# EAGLE design sVNS_16chan (EAGLE 9.6.2)

## Sheet 1 of 3
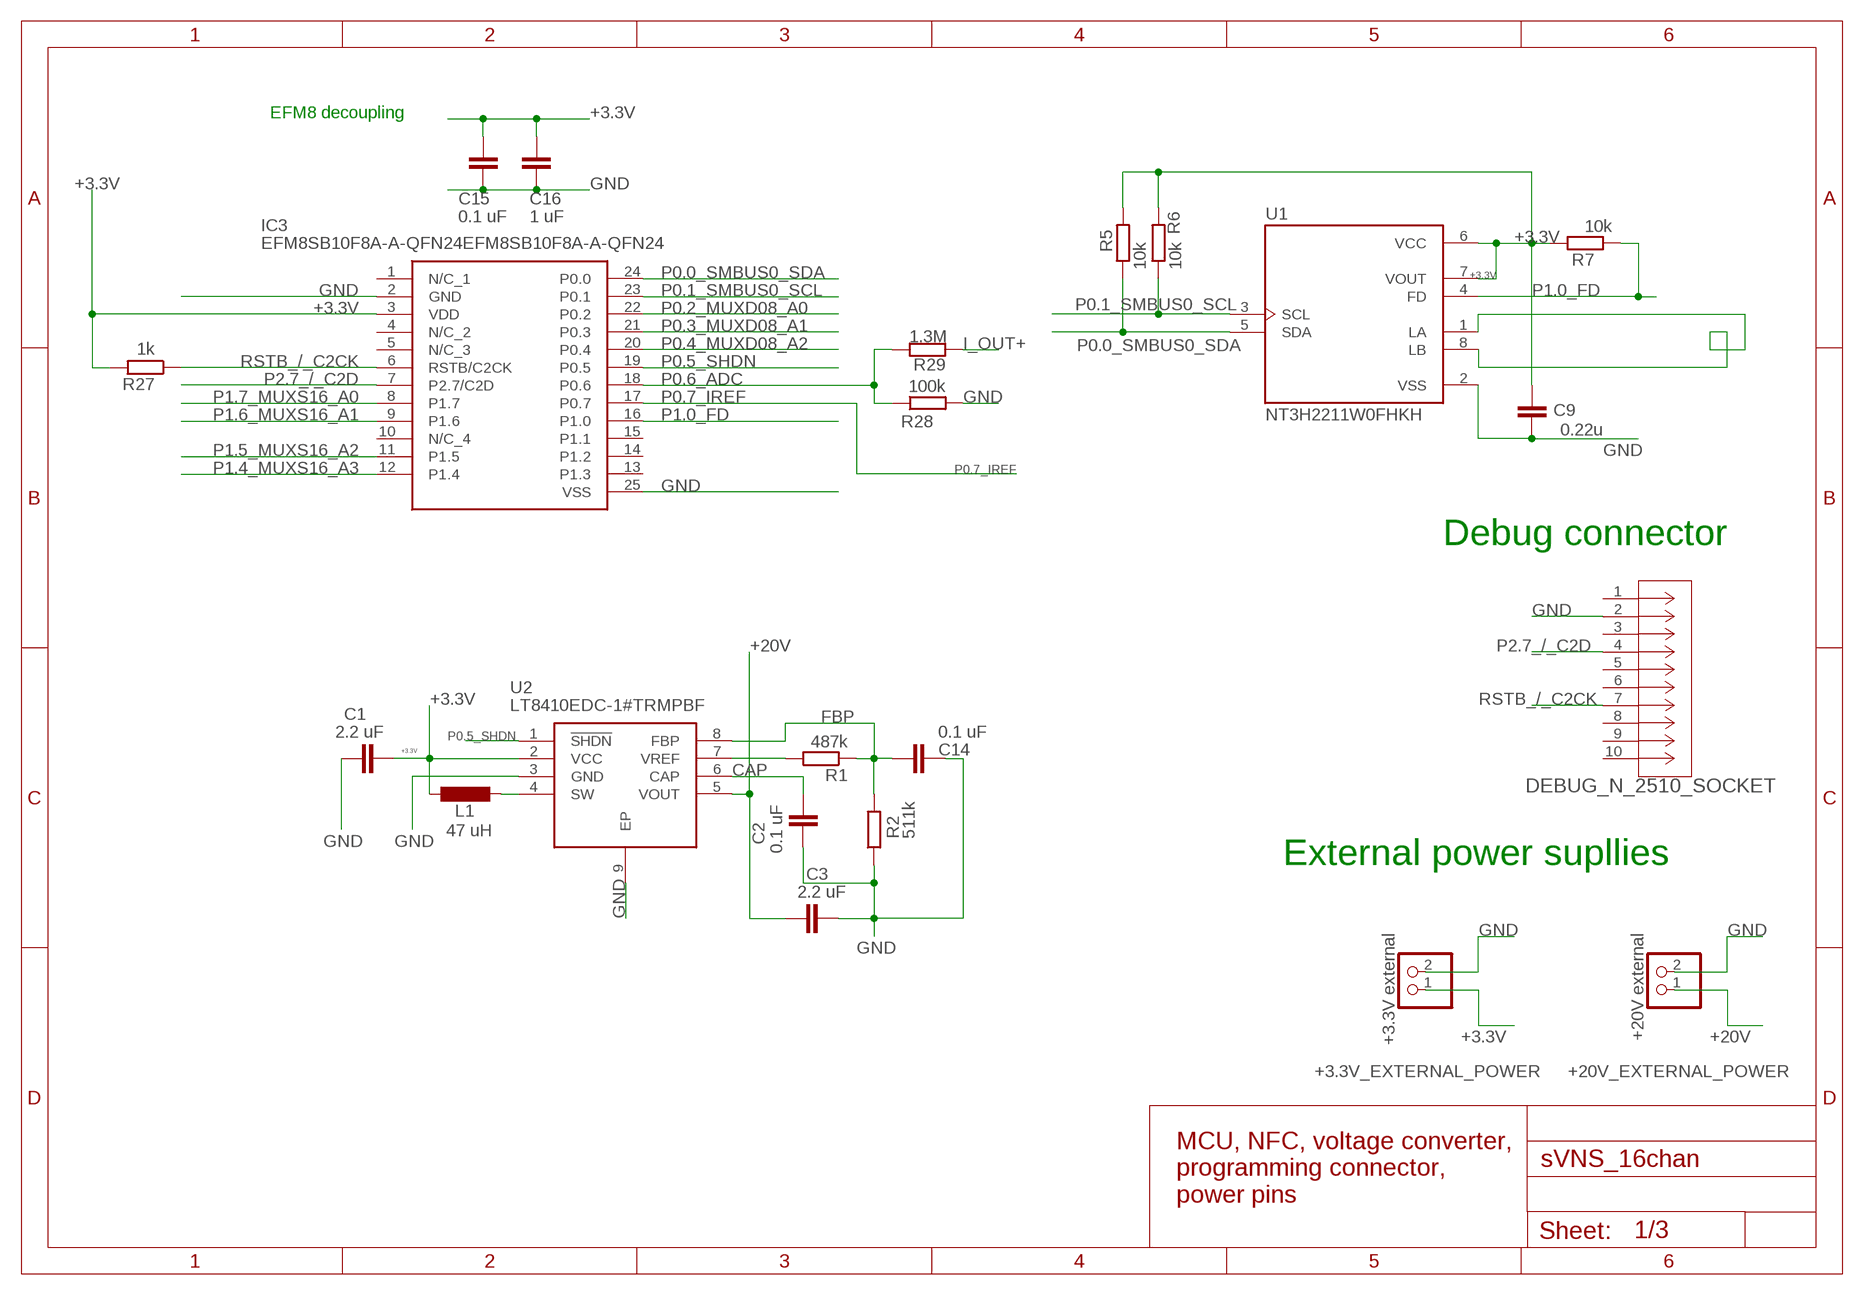
[diagram p0: schematic, sheet 1]

### Parts
+3.3V_EXTERNAL_POWER  +3.3V external  PINHD-1X2  [1X02]
+20V_EXTERNAL_POWER  +20V external  PINHD-1X2  [1X02]
C1  2.2 uF  C-EUC0603  [C0603]
C2  0.1 uF  C-EUC0603  [C0603]
C3  2.2 uF  C-EUC0603  [C0603]
C9  0.22u  C-EUC0603  [C0603]
C14  0.1 uF  C-EUC0603  [C0603]
C15  0.1 uF  C-EUC0603  [C0603]
C16  1 uF  C-EUC0603  [C0603]
DEBUG_N_2510_SOCKET  N2510-6002RB  [CONN_6002RB_3MM]
IC3  EFM8SB10F8A-A-QFN24EFM8SB10F8A-A-QFN24  [QFN50P400X400X80-25T245N]
L1  47 uH  0603PS-473KRC0603PS  [0603PS-473KRC]
R1  487k  R-EU_R0603  [R0603]
R2  511k  R-EU_R0603  [R0603]
R5  10k  R-EU_R0603  [R0603]
R6  10k  R-EU_R0603  [R0603]
R7  10k  R-EU_R0603  [R0603]
R27  1k  R-EU_R0603  [R0603]
R28  100k  R-EU_R0603  [R0603]
R29  1.3M  R-EU_R0603  [R0603]
U1  NT3H2211W0FHKH  [IC_NT3H2211W0FHKH]
U2  LT8410EDC-1#TRMPBF  [SON45P200X200X80-9N]

### Nets
+3.3V: +3.3V_EXTERNAL_POWER.1 C1.2 C9.1 C15.2 C16.1 IC3.3(VDD) L1.P$1 R5.2 R6.2 R7.2 R27.2 U1.6(VCC) U1.7(VOUT) U2.2(VCC) ; also sheet 2
+20V: +20V_EXTERNAL_POWER.1 C3.1 U2.5(VOUT) ; also sheet 2,3
CAP: C2.2 U2.6(CAP)
FBP: C14.2 R1.1 R2.2 U2.8(FBP)
GND: +3.3V_EXTERNAL_POWER.2 +20V_EXTERNAL_POWER.2 C1.1 C2.1 C3.2 C9.2 C14.1 C15.1 C16.2 DEBUG_N_2510_SOCKET.2 IC3.2(GND) IC3.25(VSS) R2.1 R28.2 U1.2(VSS) U2.3(GND) U2.9(EP) ; also sheet 2,3
I_OUT+: R29.1 ; also sheet 2
LA: U1.1(LA) U1.8(LB)
P0.0_SMBUS0_SDA: IC3.24(P0.0) R5.1 U1.5(SDA)
P0.1_SMBUS0_SCL: IC3.23(P0.1) R6.1 U1.3(SCL)
P0.2_MUXD08_A0: IC3.22(P0.2) ; also sheet 2
P0.3_MUXD08_A1: IC3.21(P0.3) ; also sheet 2
P0.4_MUXD08_A2: IC3.20(P0.4) ; also sheet 2
P0.5_SHDN: IC3.19(P0.5) U2.1(!SHDN) ; also sheet 2,3
P0.6_ADC: IC3.18(P0.6) R28.1 R29.2
P0.7_IREF: IC3.17(P0.7) ; also sheet 2
P1.0_FD: IC3.16(P1.0) R7.1 U1.4(FD)
P1.4_MUXS16_A3: IC3.12(P1.4) ; also sheet 3
P1.5_MUXS16_A2: IC3.11(P1.5) ; also sheet 3
P1.6_MUXS16_A1: IC3.9(P1.6) ; also sheet 3
P1.7_MUXS16_A0: IC3.8(P1.7) ; also sheet 3
P2.7_/_C2D: DEBUG_N_2510_SOCKET.4 IC3.7(P2.7/C2D)
RSTB_/_C2CK: DEBUG_N_2510_SOCKET.7 IC3.6(RSTB/C2CK) R27.1
SW: L1.P$2 U2.4(SW)
VREF: R1.2 U2.7(VREF)
Unconnected: DEBUG_N_2510_SOCKET.1 DEBUG_N_2510_SOCKET.3 DEBUG_N_2510_SOCKET.5 DEBUG_N_2510_SOCKET.6 DEBUG_N_2510_SOCKET.8 DEBUG_N_2510_SOCKET.9 DEBUG_N_2510_SOCKET.10 IC3.1(N/C_1) IC3.4(N/C_2) IC3.5(N/C_3) IC3.10(N/C_4) IC3.13(P1.3) IC3.14(P1.2) IC3.15(P1.1)

### Notes on the sheet
- EFM8 decoupling
- Debug connector
- External power supllies
- MCU, NFC, voltage converter, 
  programming connector, 
  power pins

## Sheet 2 of 3
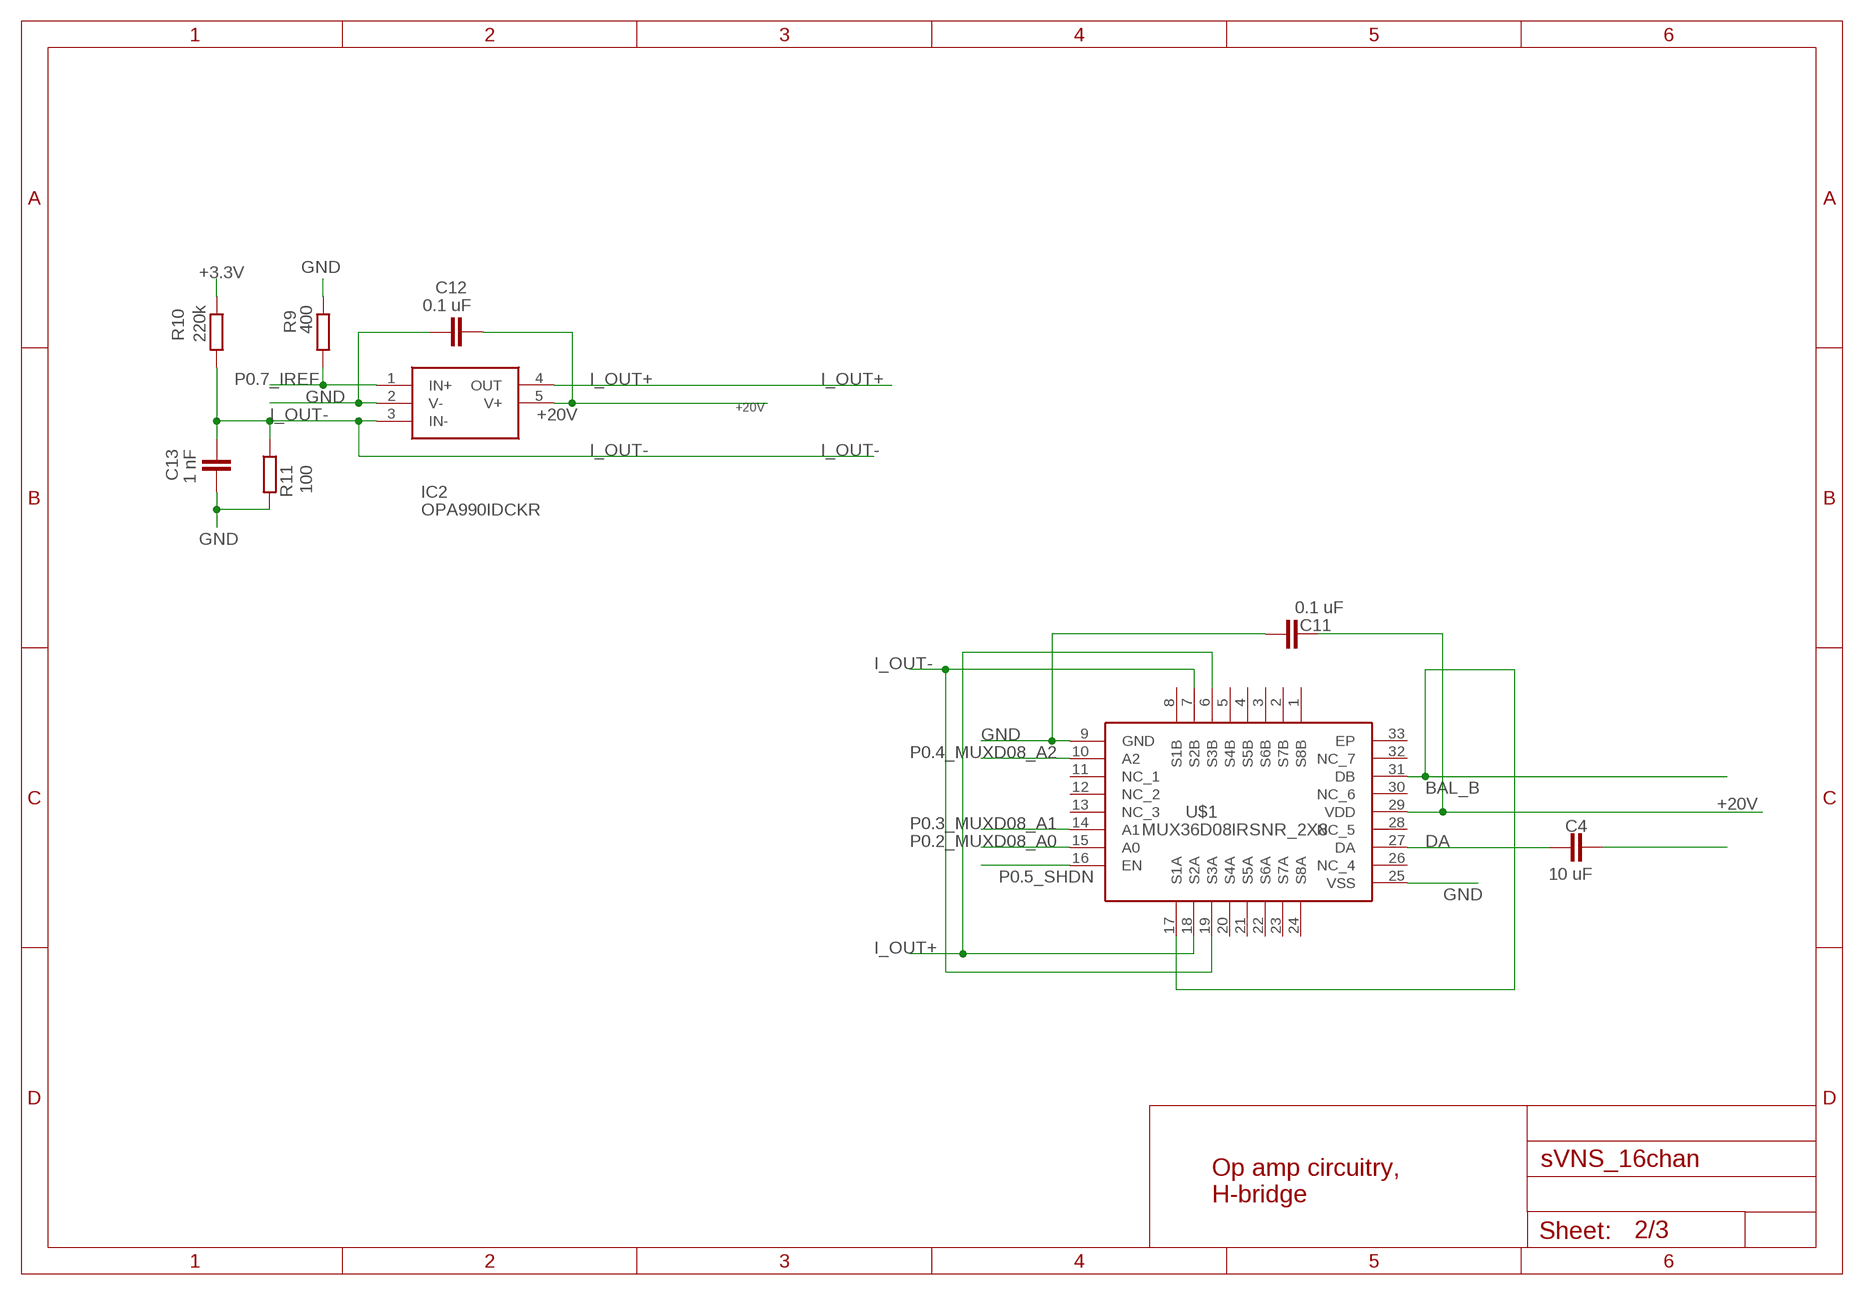
[diagram p1: schematic, sheet 2]

### Parts
C4  10 uF  C-EUC0603  [C0603]
C11  0.1 uF  C-EUC0603  [C0603]
C12  0.1 uF  C-EUC0603  [C0603]
C13  1 nF  C-EUC0603  [C0603]
IC2  OPA990IDCKR  [SOT65P210X110-5N]
R9  400  R-EU_R0603  [R0603]
R10  220k  R-EU_R0603  [R0603]
R11  100  R-EU_R0603  [R0603]
U$1  MUX36D08IRSNR_2X8  [QFN40P400X400X80-33N_2X8]

### Nets
+3.3V: R10.1 ; also sheet 1
+20V: C11.2 C12.1 IC2.5(V+) U$1.29(VDD) ; also sheet 1,3
BAL_A: C4.2 ; also sheet 3
BAL_B: U$1.17(S1A) U$1.31(DB) ; also sheet 3
DA: C4.1 U$1.27(DA)
GND: C11.1 C12.2 C13.1 IC2.2(V-) R9.1 R11.2 U$1.9(GND) U$1.25(VSS) ; also sheet 1,3
I_OUT+: IC2.4(OUT) U$1.6(S3B) U$1.18(S2A) ; also sheet 1
I_OUT-: C13.2 IC2.3(IN-) R10.2 R11.1 U$1.7(S2B) U$1.19(S3A)
P0.2_MUXD08_A0: U$1.15(A0) ; also sheet 1
P0.3_MUXD08_A1: U$1.14(A1) ; also sheet 1
P0.4_MUXD08_A2: U$1.10(A2) ; also sheet 1
P0.5_SHDN: U$1.16(EN) ; also sheet 1,3
P0.7_IREF: IC2.1(IN+) R9.2 ; also sheet 1
Unconnected: U$1.1(S8B) U$1.2(S7B) U$1.3(S6B) U$1.4(S5B) U$1.5(S4B) U$1.8(S1B) U$1.11(NC_1) U$1.12(NC_2) U$1.13(NC_3) U$1.20(S4A) U$1.21(S5A) U$1.22(S6A) U$1.23(S7A) U$1.24(S8A) U$1.26(NC_4) U$1.28(NC_5) U$1.30(NC_6) U$1.32(NC_7) U$1.33(EP)

### Notes on the sheet
- Op amp circuitry,
  H-bridge

## Sheet 3 of 3
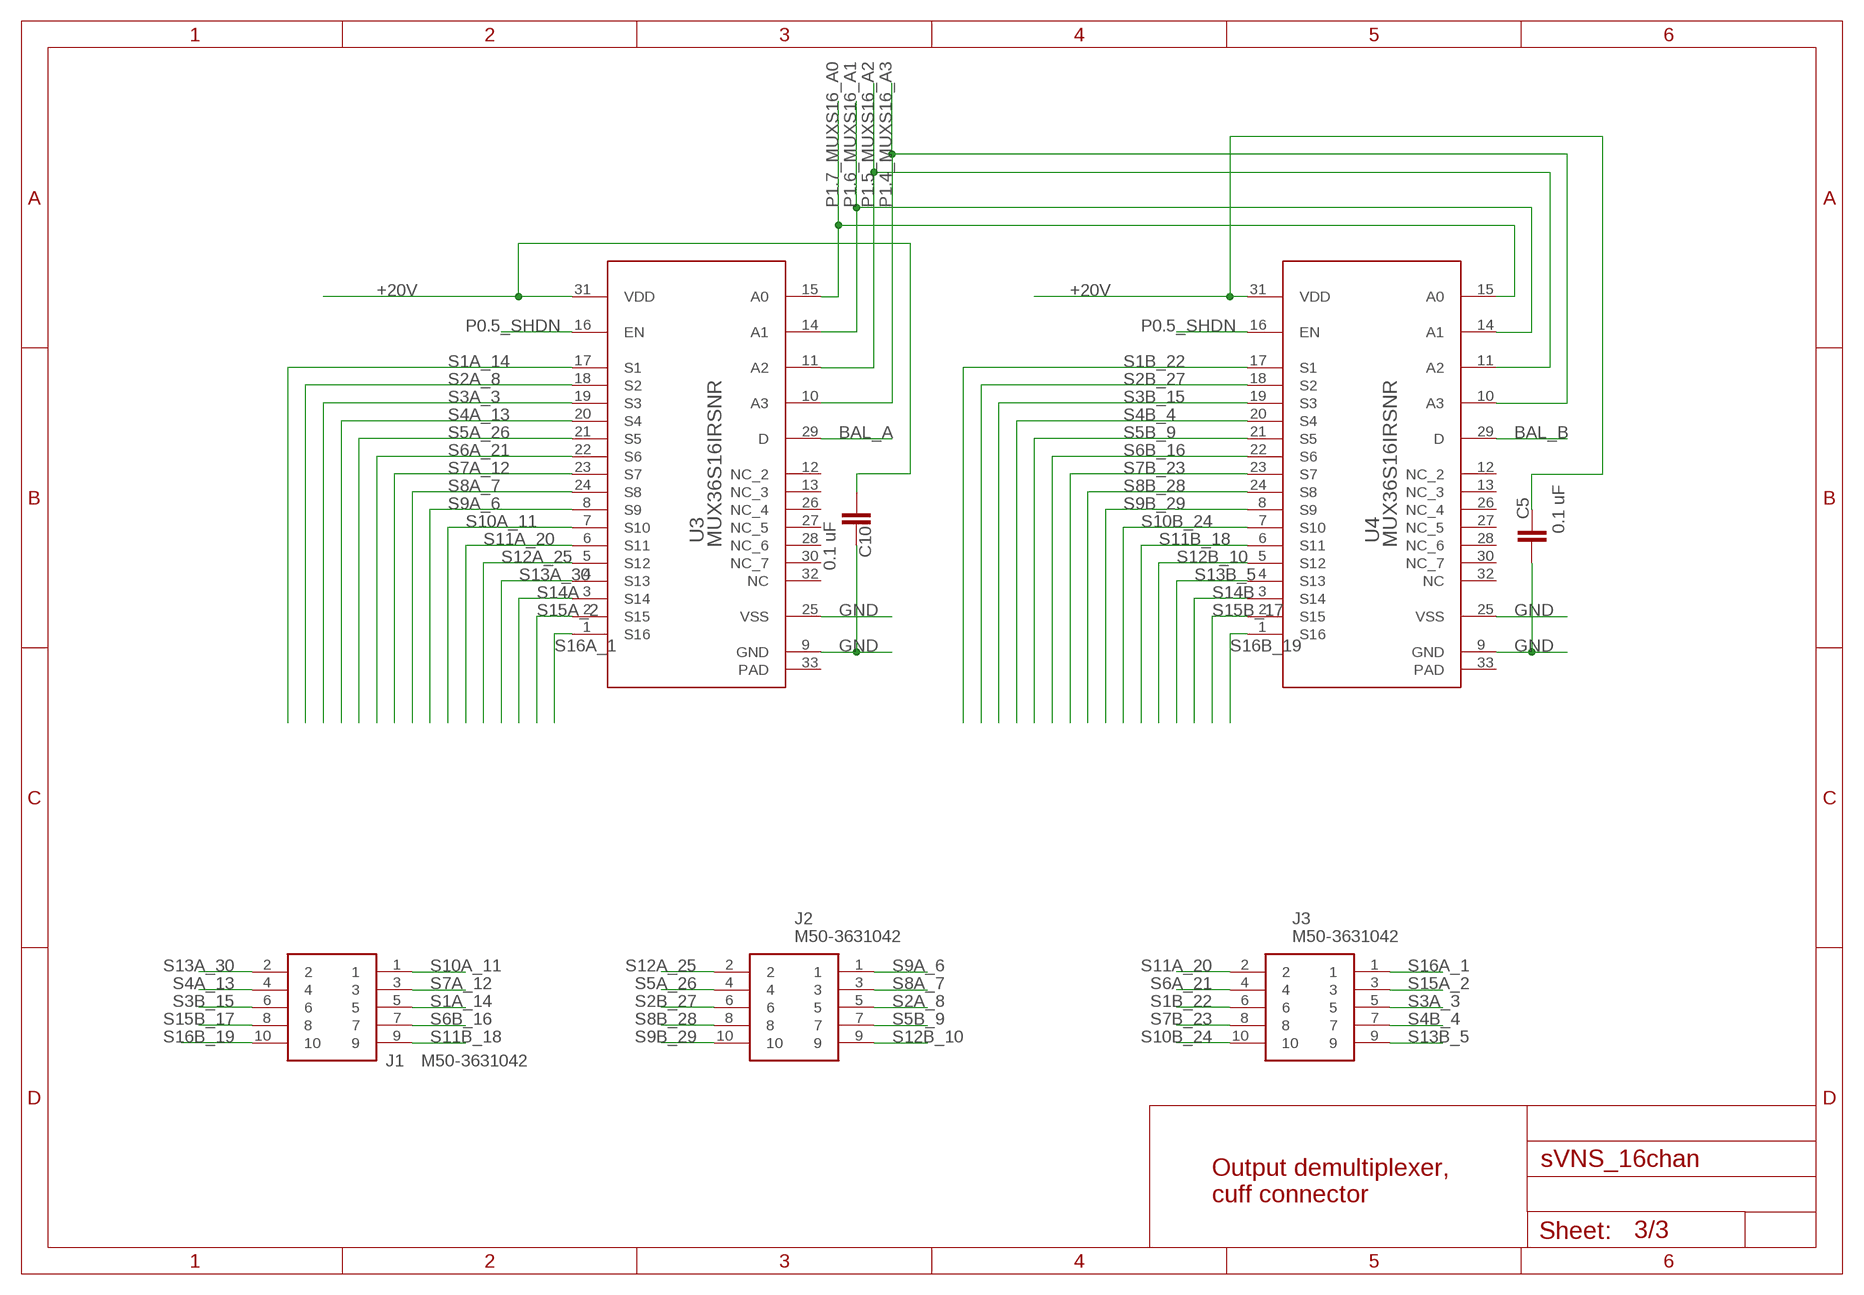
[diagram p2: schematic, sheet 3]

### Parts
C5  0.1 uF  C-EUC0603  [C0603]
C10  0.1 uF  C-EUC0603  [C0603]
J1  M50-3631042  [M503631042]
J2  M50-3631042  [M503631042]
J3  M50-3631042  [M503631042]
U3  MUX36S16IRSNR  [RSN0032B]
U4  MUX36S16IRSNR  [RSN0032B]

### Nets
+20V: C5.2 C10.1 U3.31(VDD) U4.31(VDD) ; also sheet 1,2
BAL_A: U3.29(D) ; also sheet 2
BAL_B: U4.29(D) ; also sheet 2
GND: C5.1 C10.2 U3.9(GND) U3.25(VSS) U4.9(GND) U4.25(VSS) ; also sheet 1,2
P0.5_SHDN: U3.16(EN) U4.16(EN) ; also sheet 1,2
P1.4_MUXS16_A3: U3.10(A3) U4.10(A3) ; also sheet 1
P1.5_MUXS16_A2: U3.11(A2) U4.11(A2) ; also sheet 1
P1.6_MUXS16_A1: U3.14(A1) U4.14(A1) ; also sheet 1
P1.7_MUXS16_A0: U3.15(A0) U4.15(A0) ; also sheet 1
S1A_14: J1.5 U3.17(S1)
S1B_22: J3.6 U4.17(S1)
S2A_8: J2.5 U3.18(S2)
S2B_27: J2.6 U4.18(S2)
S3A_3: J3.5 U3.19(S3)
S3B_15: J1.6 U4.19(S3)
S4A_13: J1.4 U3.20(S4)
S4B_4: J3.7 U4.20(S4)
S5A_26: J2.4 U3.21(S5)
S5B_9: J2.7 U4.21(S5)
S6A_21: J3.4 U3.22(S6)
S6B_16: J1.7 U4.22(S6)
S7A_12: J1.3 U3.23(S7)
S7B_23: J3.8 U4.23(S7)
S8A_7: J2.3 U3.24(S8)
S8B_28: J2.8 U4.24(S8)
S9A_6: J2.1 U3.8(S9)
S9B_29: J2.10 U4.8(S9)
S10A_11: J1.1 U3.7(S10)
S10B_24: J3.10 U4.7(S10)
S11A_20: J3.2 U3.6(S11)
S11B_18: J1.9 U4.6(S11)
S12A_25: J2.2 U3.5(S12)
S12B_10: J2.9 U4.5(S12)
S13A_30: J1.2 U3.4(S13)
S13B_5: J3.9 U4.4(S13)
S14A: U3.3(S14)
S14B: U4.3(S14)
S15A_2: J3.3 U3.2(S15)
S15B_17: J1.8 U4.2(S15)
S16A_1: J3.1 U3.1(S16)
S16B_19: J1.10 U4.1(S16)
Unconnected: U3.12(NC_2) U3.13(NC_3) U3.26(NC_4) U3.27(NC_5) U3.28(NC_6) U3.30(NC_7) U3.32(NC) U3.33(PAD) U4.12(NC_2) U4.13(NC_3) U4.26(NC_4) U4.27(NC_5) U4.28(NC_6) U4.30(NC_7) U4.32(NC) U4.33(PAD)

### Notes on the sheet
- Output demultiplexer,
  cuff connector

## Library data of the parts
+3.3V_EXTERNAL_POWER +20V_EXTERNAL_POWER = pinhead:PINHD-1X2: PIN HEADER
C1-C5 C9-C16 = rcl:C-EU: CAPACITOR, European symbol; SPICEPREFIX: C
DEBUG_N_2510_SOCKET = N2510-6002RB:N2510-6002RB; COPYRIGHT: Copyright (C) 2021 Ultra Librarian. All rights reserved.; MANUFACTURER_PART_NUMBER: N2510-6002RB; MFR_NAME: 3M
IC2 = sVNScomponents:OPA990IDCKR: Texas Instruments Source: Datasheet <https://www.ti.com/lit/gpn/OPA990>; DESCRIPTION: Texas Instruments; HEIGHT: 1.1mm; MANUFACTURER_NAME: Texas Instruments; MANUFACTURER_PART_NUMBER: OPA990IDCKR; MOUSER_PART_NUMBER: 595-OPA990IDCKR; MOUSER_PRICE-STOCK: https://www.mouser.co.uk/ProductDetail/Texas-Instruments/OPA990IDCKR?qs=XeJtXLiO41TSF5QBGuARgQ%3D%3D
IC3 = sVNS_16chan_lib:EFM8SB10F8A-A-QFN24
J1-J3 = M50-3631042:M50-3631042: Headers & Wire Housings 10 WAY SIL VERT SMT P/HDR Source: Datasheet <https://cdn.harwin.com/pdfs/M50-363.pdf>; DESCRIPTION: Headers & Wire Housings 10 WAY SIL VERT SMT P/HDR; HEIGHT: 4.7mm; MANUFACTURER_NAME: Harwin; MANUFACTURER_PART_NUMBER: M50-3631042; MOUSER_PART_NUMBER: 855-M50-3631042; MOUSER_PRICE-STOCK: https://www.mouser.co.uk/ProductDetail/Harwin/M50-3631042?qs=%252BdQmOuGyFcGLl60dqjvGKA%3D%3D
L1 = CustomLibVNS:0603PS-473KRC: Shielded High SRF Inductors – 0603PS; L = 47 uH; Package 0603; Isat = 100 mA
R1 R2 R5-R7 R9-R11 R27-R29 = rcl:R-EU_: RESISTOR, European symbol; SPICEPREFIX: R
U1 = sVNScomponents:NT3H2211W0FHKH: 13.56 MHz I2C NFC NTAG I2C Plus NFC Forum Type 2 Tag RFID Transponder - XQFN-8 Check prices <https://pricing.snapeda.com/parts/NT3H2211W0FHKH/NXP%20USA/view-part?ref=eda>; AVAILABILITY: In Stock; DESCRIPTION: RFID Transponder IC 13.56MHz ISO 14443 I²C 3.6V 8-XFQFN Exposed Pad; MF: NXP USA; MP: NT3H2211W0FHKH; PACKAGE: XQFN-8 NXP Semiconductors; PRICE: None; PURCHASE-URL: https://pricing.snapeda.com/search/part/NT3H2211W0FHKH/?ref=eda
U2 = sVNScomponents:LT8410EDC-1#TRMPBF: Linear Technology LT8410EDC-1#TRMPBF, Boost Converter, Boost 8mA, -0.3 40 V, 8-Pin DFN Source: Datasheet <http://www.linear.com/docs/26988>; DESCRIPTION: Linear Technology LT8410EDC-1#TRMPBF, Boost Converter, Boost 8mA, -0.3 40 V, 8-Pin DFN; HEIGHT: 0.8mm; MANUFACTURER_NAME: Linear Technology; MANUFACTURER_PART_NUMBER: LT8410EDC-1#TRMPBF; MOUSER_PART_NUMBER: 584-8410EDC-1TRMPBF; MOUSER_PRICE-STOCK: https://www.mouser.co.uk/ProductDetail/Analog-Devices-Linear-Technology/LT8410EDC-1TRMPBF?qs=hVkxg5c3xu%2Ftydmd3V99bg%3D%3D
U3 U4 = sVNS_16chan_lib:MUX36S16IRSNR; COPYRIGHT: Copyright (C) 2022 Ultra Librarian. All rights reserved.; MANUFACTURER_PART_NUMBER: MUX36S16IRSNR; MFR_NAME: Texas Instruments; REFDES: RefDes; TYPE: TYPE
U$1 = sVNScomponents:MUX36D08IRSNR_2X8

## Board
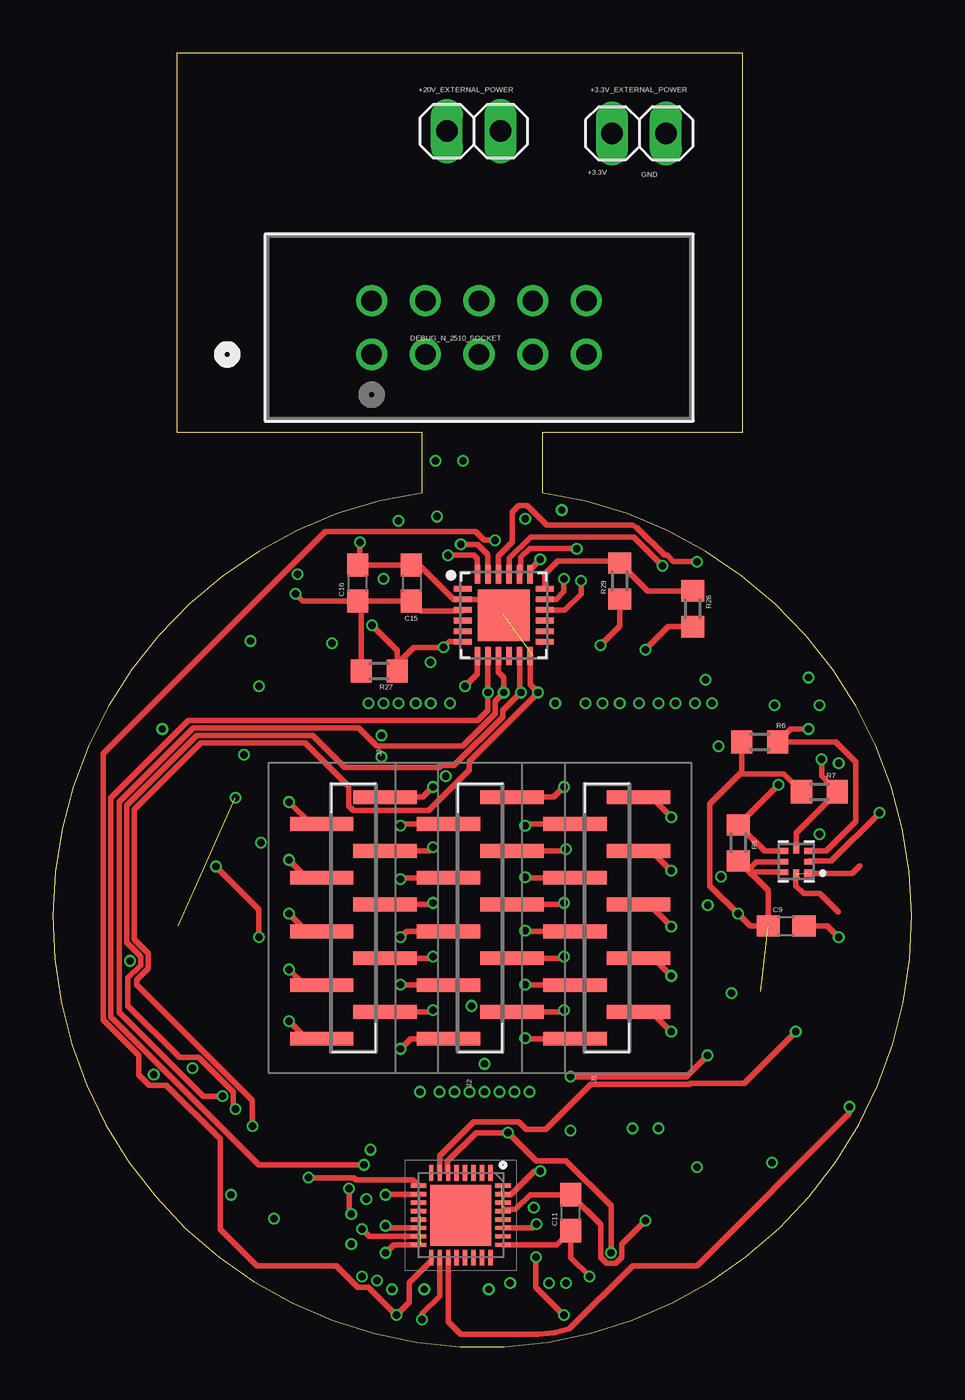
[diagram p3: board, top side]
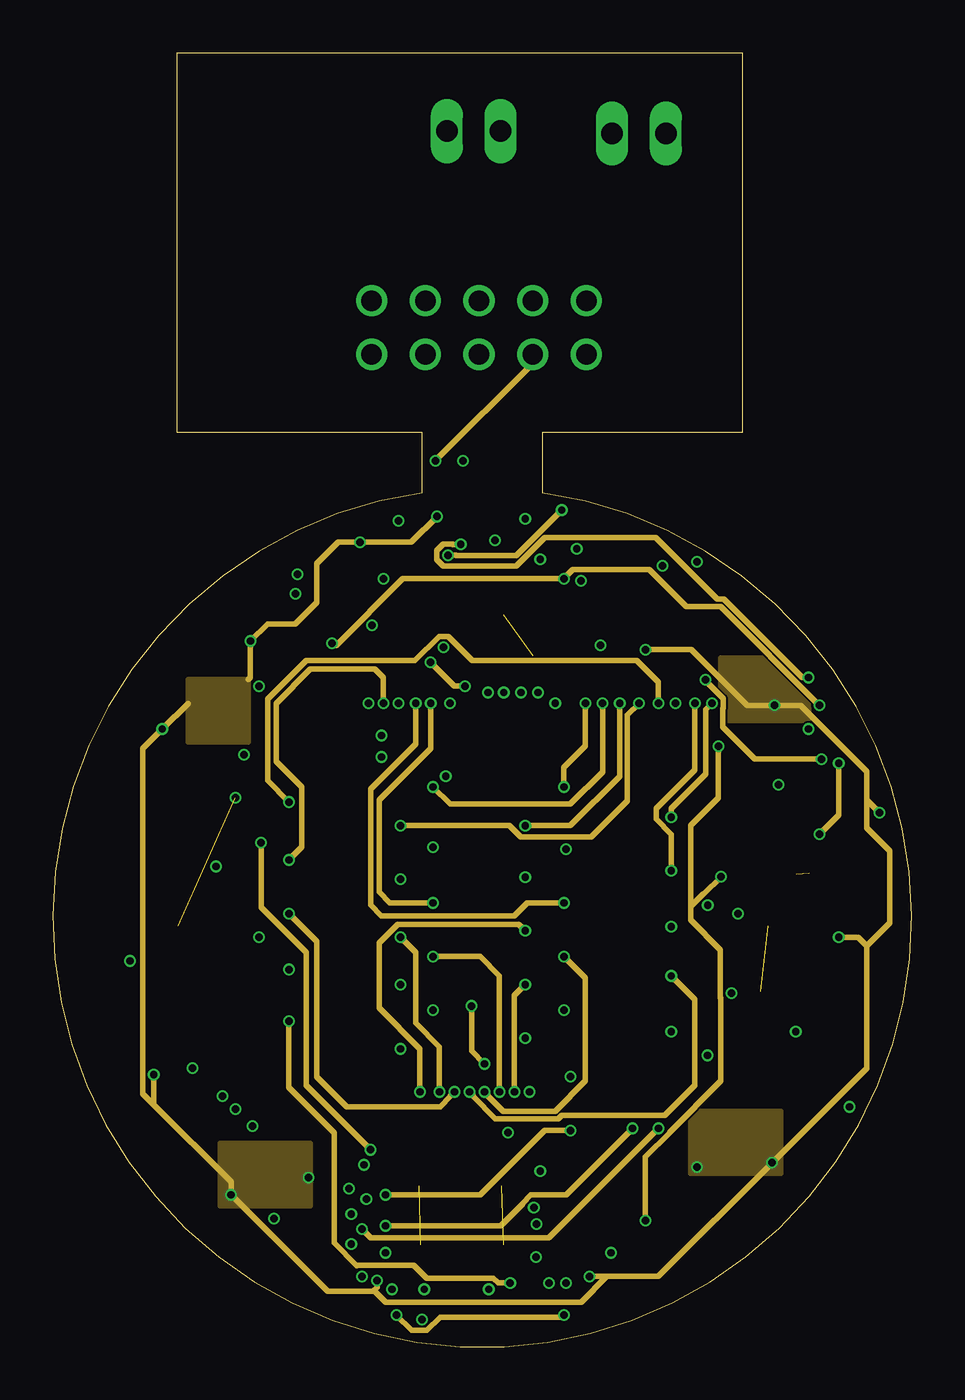
[diagram p4: board, inner layer Route2(GND)]
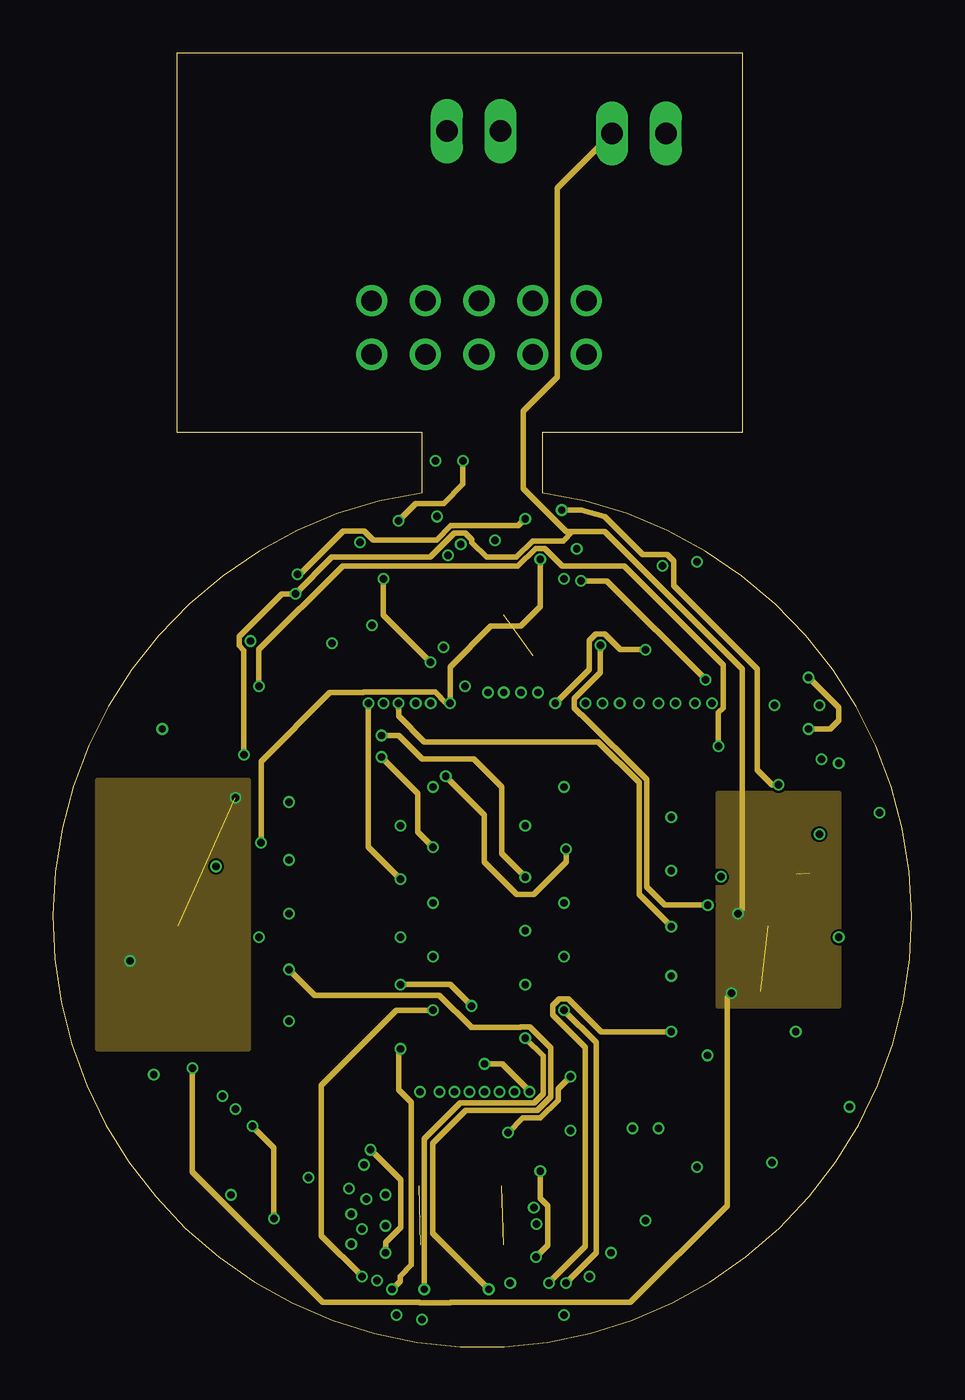
[diagram p5: board, inner layer Route15(power)]
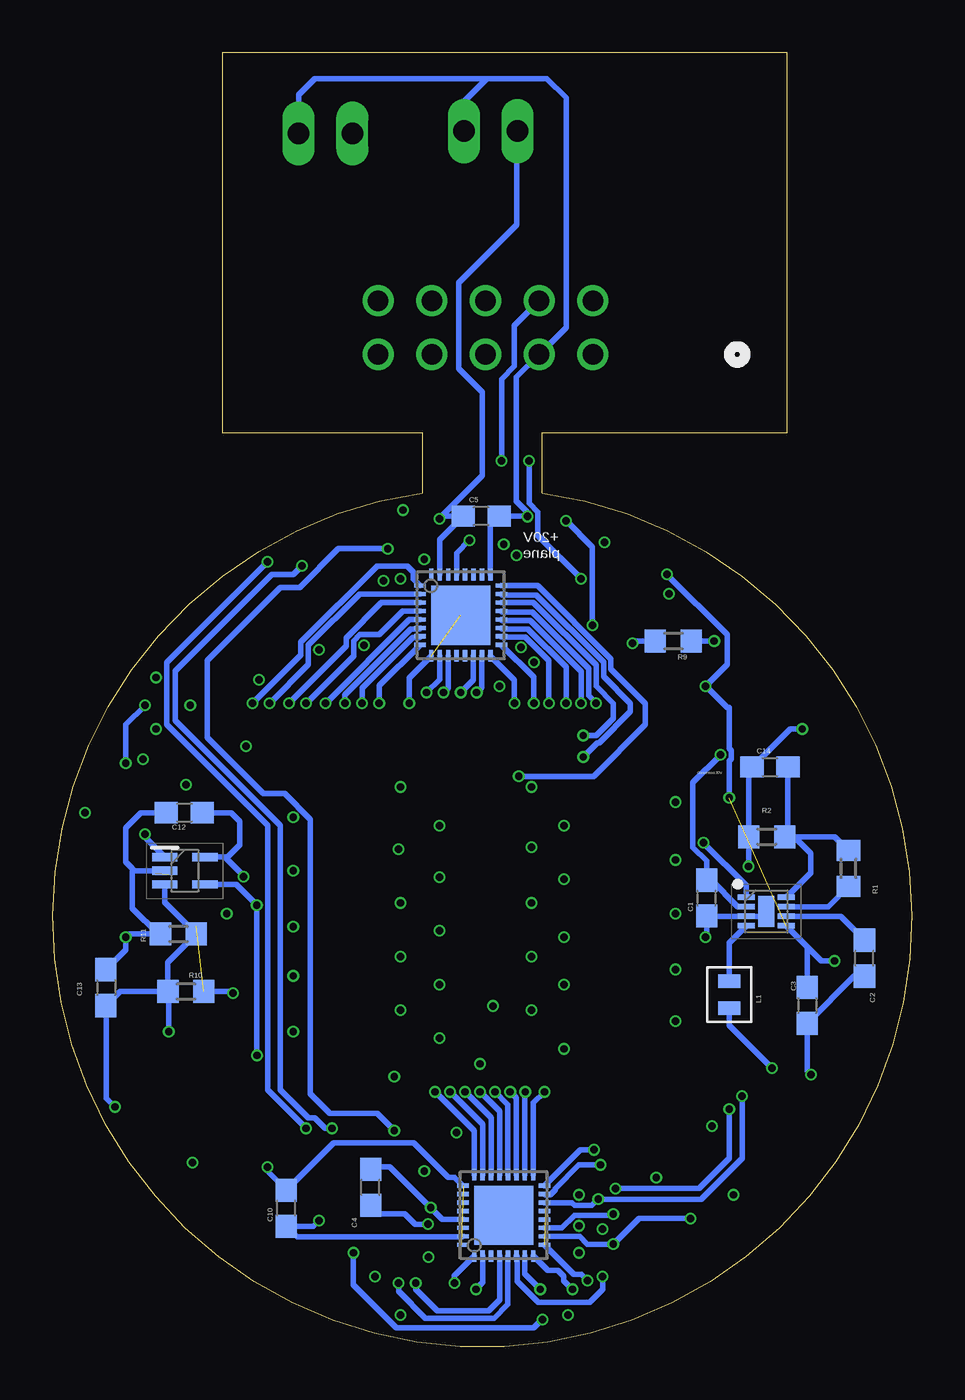
[diagram p6: board, bottom side, seen from below]

Size 40.63 x 61.24 mm. Coordinates in mm from the lower left corner, seen from the top.
Outline: 5.89,43.25 5.89,61.24 32.61,61.24 32.61,43.25 23.16,43.25 23.16,40.41 arc-344 17.47,40.41 17.47,43.25 5.89,43.25
Copper layers (1+2*15+16): Top 0.018mm / dielectric 0.18mm / Route2(GND) 0.035mm / dielectric 1.6mm / Route15(power) 0.035mm / dielectric 0.18mm / Bottom 0.018mm
Design rules "eC_4Layer_PClass8_BaseCopperO12-I18 *": minimum track width 0.1mm, minimum drill 0.25mm, track to track 0.1mm, track to pad 0.1mm, pad to pad 0.1mm, via to via 0.1mm, smd to smd 0mil, copper to edge 0.25mm, drill to drill 0.35mm, minimum pad ring 0.15mm, minimum via ring 0.1mm, stop-mask expansion 0mil, vias tented up to drill 0.45mm, thermal gap 0.2mm

### Footprints (pad centres in the part's own frame; a part is rotated, then mirrored left to right if it is on the bottom)
1X02 = drill 1.016 long: 1 -1.27,0; 2 1.27,0
C0603 = smd 1.1 x 1: 1 -0.85,0; 2 0.85,0
CONN_6002RB_3MM = drill 0.965 pad 1.473: 1 0,0; 2 2.54,0; 3 5.08,0; 4 7.62,0; 5 10.16,0; 6 0,2.54; 7 2.54,2.54; 8 5.08,2.54; 9 7.62,2.54; 10 10.16,2.54
SOT65P210X110-5N = smd 1.2 x 0.4: 1 -0.95,0.65; 2 -0.95,0; 3 -0.95,-0.65; 4 0.95,-0.65; 5 0.95,0.65
QFN50P400X400X80-25T245N = smd 0.86 x 0.264: 1 -1.935,1.25; 2 -1.935,0.75; 3 -1.935,0.25; 4 -1.935,-0.25; 5 -1.935,-0.75; 6 -1.935,-1.25; 13 1.935,-1.25; 14 1.935,-0.75; 15 1.935,-0.25; 16 1.935,0.25; 17 1.935,0.75; 18 1.935,1.25 | smd 0.264 x 0.86: 7 -1.25,-1.935; 8 -0.75,-1.935; 9 -0.25,-1.935; 10 0.25,-1.935; 11 0.75,-1.935; 12 1.25,-1.935; 19 1.25,1.935; 20 0.75,1.935; 21 0.25,1.935; 22 -0.25,1.935; 23 -0.75,1.935; 24 -1.25,1.935 | smd 2.45 x 2.45: 25 0,0
M503631042 = smd 0.65 x 3: 1 -5.715,1.5; 2 -4.445,-1.5; 3 -3.175,1.5; 4 -1.905,-1.5; 5 -0.635,1.5; 6 0.635,-1.5; 7 1.905,1.5; 8 3.175,-1.5; 9 4.445,1.5; 10 5.715,-1.5
0603PS-473KRC = smd 1.02 x 0.64: P$1 0,0.64; P$2 0,-0.64
R0603 = smd 1 x 1.1: 1 -0.85,0; 2 0.85,0
IC_NT3H2211W0FHKH = smd 0.45 x 0.37: 1 -0.6,0.55 | smd 0.45 x 0.27: 2 -0.6,0; 3 -0.6,-0.5; 5 0.6,-0.5; 6 0.6,0; 7 0.6,0.5 | smd 0.27 x 0.45: 4 0,-0.6; 8 0,0.6
SON45P200X200X80-9N = smd 0.8 x 0.25: 1 -0.95,0.675; 2 -0.95,0.225; 3 -0.95,-0.225; 4 -0.95,-0.675; 5 0.95,-0.675; 6 0.95,-0.225; 7 0.95,0.225; 8 0.95,0.675 | smd 0.74 x 1.47: 9 0,0
RSN0032B = smd 0.55 x 0.2: 1 -1.925,1.4; 2 -1.925,1; 3 -1.925,0.6; 4 -1.925,0.2; 5 -1.925,-0.2; 6 -1.925,-0.6; 7 -1.925,-1; 8 -1.925,-1.4; 17 1.925,-1.4; 18 1.925,-1; 19 1.925,-0.6; 20 1.925,-0.2; 21 1.925,0.2; 22 1.925,0.6; 23 1.925,1; 24 1.925,1.4 | smd 0.2 x 0.55: 9 -1.4,-1.925; 10 -1,-1.925; 11 -0.6,-1.925; 12 -0.2,-1.925; 13 0.2,-1.925; 14 0.6,-1.925; 15 1,-1.925; 16 1.4,-1.925; 25 1.4,1.925; 26 1,1.925; 27 0.6,1.925; 28 0.2,1.925; 29 -0.2,1.925; 30 -0.6,1.925; 31 -1,1.925; 32 -1.4,1.925 | smd 2.8 x 2.8: 33 0,0 | smd 0.5 x 0.5: 34 0,1.15; 35 -1.15,0; 37 1.15,0; 38 0,-1.15
QFN40P400X400X80-33N_2X8 = smd 0.75 x 0.2: 1 -2,1.4; 2 -2,1; 3 -2,0.6; 4 -2,0.2; 5 -2,-0.2; 6 -2,-0.6; 7 -2,-1; 8 -2,-1.4; 17 2,-1.4; 18 2,-1; 19 2,-0.6; 20 2,-0.2; 21 2,0.2; 22 2,0.6; 23 2,1; 24 2,1.4 | smd 0.2 x 0.75: 9 -1.4,-2; 10 -1,-2; 11 -0.6,-2; 12 -0.2,-2; 13 0.2,-2; 14 0.6,-2; 15 1,-2; 16 1.4,-2; 25 1.4,2; 26 1,2; 27 0.6,2; 28 0.2,2; 29 -0.2,2; 30 -0.6,2; 31 -1,2; 32 -1.4,2 | smd 2.9 x 2.9: 33 0,0

### Placement (x,y rotation side)
+3.3V_EXTERNAL_POWER  27.73,57.43 0 top
+20V_EXTERNAL_POWER  19.91,57.53 0 top
C1  9.7,21.23 90 bottom
C2  2.23,18.39 90 bottom
C3  4.95,16.15 270 bottom
C4  25.6,7.54 90 bottom
C5  20.37,39.32 180 bottom
C9  34.69,19.91 0 top
C10  29.59,6.55 90 bottom
C11  24.51,6.35 90 top
C12  34.41,25.27 180 bottom
C13  38.12,16.99 270 bottom
C14  6.7,27.43 0 bottom
C15  16.96,36.14 270 top
C16  14.42,36.14 90 top
DEBUG_N_2510_SOCKET  15.08,46.96 0 top
IC2  34.39,22.53 0 bottom
IC3  21.33,34.62 0 top
J1  26.21,20.29 90 top
J2  20.22,20.29 90 top
J3  14.22,20.29 90 top
L1  8.63,16.66 180 bottom
R1  2.99,22.63 270 bottom
R2  6.86,24.13 0 bottom
R5  32.43,23.85 270 top
R6  33.45,28.62 180 top
R7  36.27,26.26 180 top
R9  11.27,33.4 180 bottom
R10  34.34,16.81 180 bottom
R11  34.69,19.53 180 bottom
R27  15.44,31.98 180 top
R28  30.27,34.92 270 top
R29  26.82,36.24 90 top
U1  35.18,22.96 180 top
U2  6.88,20.6 0 bottom
U3  19.3,6.22 90 bottom
U4  21.33,34.62 0 bottom
U$1  19.3,6.22 270 top

### Tracks (layer width: path | path; a pad name or v marks a point on that pad's centre or on a via)
+3.3V  (via drill 0.35)  (1 unrouted)
  Top 0.254: U1.6 34.55,22.93 33.28,22.93 32.9,22.55 | U1.7 32.98,22.46 32.9,22.55 | 32.9,22.55 R5.2 33.84,21.59 C9.1 32.99,19.91 v32.41,20.49 31.09,21.82 31.09,25.68 32.51,27.1 | 32.51,27.1 32.6,27.19 R6.2 | IC3.3 19.36,34.83 17.43,34.83 C15.2 C16.1 | C16.1 11.82,35.29 v11.48,35.63 | C16.1 14.59,35.12 R27.2 | R7.2 34.58,27.1 32.51,27.1
  Route15(power) 0.254: v9.04,28.01 9.04,32.96 8.82,33.18 8.82,33.62 10.83,35.63 v11.48,35.63 13.21,37.36 17.85,37.36 18.98,38.5 19.52,38.5 19.83,38.19 19.83,38.05 20.52,37.36 21.92,37.36 22.7,38.14 24.14,38.14 24.58,38.58 | v32.41,20.49 32.61,20.7 32.61,32.08 26.11,38.58 24.58,38.58 | v6.6,13.18 6.6,8.27 12.77,2.1 17.34,2.1 17.36,2.09 18.81,2.09 18.83,2.1 27.33,2.1 31.9,6.68 31.9,16.53 v32.1,16.74 | 24.58,38.58 24.28,38.58 22.25,40.61 22.25,44.27 23.87,45.89 23.87,54.84 +3.3V_EXTERNAL_POWER.1
  Bottom 0.254: U2.2 8.22,20.82 9.49,22.08 C1.2 9.7,22.98 10.35,23.64 10.35,26.7 v9.04,28.01 | L1.P$1 8.63,15.21 v6.6,13.18 | R10.1 32.18,16.81 v32.1,16.74
  pour Route15(power): 31.49,26.18 37.18,26.18 37.18,16.13 31.49,16.13
+20V  (via drill 0.35)  (1 unrouted)
  Top 0.254: U$1.29 21.37,6.49 21.87,6.49 22.58,7.2 C11.2 25.91,5.79 25.91,4.23 26.21,3.94 26.62,3.94 26.92,4.23 26.92,4.84 v28.04,5.97
  Route2(GND) 0.254: v28.04,5.97 28.04,8.98 29.18,10.12 29.18,10.15 31.6,12.57 31.6,16.5 31.58,16.52 31.58,18.79 30.17,20.19 30.17,20.83 | v31.61,22.24 30.8,21.43 30.77,21.43 30.17,20.83 | 30.17,20.83 30.17,24.66 31.49,25.98 v31.49,28.42
  Route15(power) 0.254: v31.49,28.42 31.49,30.01 31.72,30.23 31.72,32.26 27.02,36.95 24.11,36.95 23.28,37.79 22.84,37.79 21.99,36.93 18.47,36.93 18.45,36.95 13.71,36.95 9.75,32.99 v9.75,31.26 | v22.35,39.19 22.01,38.85 18.83,38.85 18.17,38.19 15.16,38.19 14.74,38.6 13.74,38.6 11.69,36.55 v11.58,36.55
  Bottom 0.254: U4.31 22.33,38.2 C5.2 22.22,39.32 v22.35,39.19 20.32,41.22 20.32,45.18 21.44,46.3 21.44,50.36 18.69,53.11 18.69,57.48 +20V_EXTERNAL_POWER.1 | U3.31 21.25,5.19 29.08,5.19 C10.1 28.3,5.7 v28.04,5.97 | C3.1 4.95,18.94 U2.5 4.27,18.26 v3.66,18.26 | IC2.5 32.51,23.18 | 32.51,23.18 32.37,23.18 31.8,23.75 31.8,24.86 32.2,25.27 C12.1 | 32.51,23.18 31.61,22.28 v31.61,22.24 | v8.63,25.98 8.63,27.71 8.54,27.8 8.54,28.22 8.63,28.32 8.63,30.25 8.74,30.25 v9.75,31.26 8.74,32.28 8.74,33.7 v11.58,36.55
  pour Route15(power): 2.13,26.79 9.24,26.79 9.24,14.09 2.13,14.09
BAL_A  (via drill 0.35)
  Bottom 0.254: U3.29 22.2,6.02 v22.76,6.58 24.69,8.51 25.49,8.51 C4.2
BAL_B  (via drill 0.35)
  Top 0.254: U$1.31 21.33,7.19 21.67,7.19 22.78,8.3 v23.06,8.3 | U$1.17 17.9,4.06 16.86,3.02 16.86,2.1 v16.25,1.5 14.93,2.82 14.42,2.82 13.41,3.83 9.65,3.83 7.92,5.56 7.92,9.83 5.38,12.37 4.56,12.37 4.06,12.88 4.06,13.8 2.39,15.47 2.39,28.07 12.89,38.57 20.01,38.57 20.41,38.17 v20.93,38.17 | v22.86,4.24 22.86,2.82 v24.18,1.5
  Route2(GND) 0.254: v24.18,1.5 24.08,1.39 18.32,1.39 17.69,0.77 16.98,0.77 v16.25,1.5
  Route15(power) 0.254: v23.06,8.3 23.06,7.02 23.42,6.66 23.42,4.8 v22.86,4.24
  Bottom 0.254: U4.29 21.53,37.57 v20.93,38.17
CAP
  Bottom 0.254: C2.2 3.37,20.37 U2.6
DA  (via drill 0.35)
  Top 0.254: U$1.27 22.71,5.62 v22.89,5.8
  Bottom 0.254: v22.89,5.8 23.5,5.8 23.99,6.28 25.19,6.28 C4.1
FBP
  Bottom 0.254: U2.8 4.77,22.43 4.77,23.34 5.56,24.13 R2.2 | R2.2 5.85,24.28 C14.2 | R2.2 3.64,24.13 R1.1
GND  (via drill 0.35)  (3 unrouted)
  Top 0.254: C9.2 36.65,19.91 v37.18,19.38 | U1.2 35.81,22.99 36.84,22.99 v39.11,25.27 | v14.53,38.07 14.53,37.09 C16.2 C15.1 17.33,36.99 18.96,35.37 IC3.2 20.58,35.37 IC3.25 | R28.2 29.12,34.07 v28.04,32.99 | U$1.25 23.83,4.82 C11.1 24.51,4.21 v25.4,3.32 | U$1.9 17.03,7.9 14.32,7.9 14.23,7.99 v12.09,7.99 v12.09,8 | v9.75,19.38 9.75,20.7 v7.72,22.73
  Route2(GND) 0.254: v28.04,32.99 30.21,32.99 32.85,30.35 v34.14,30.35 35.39,30.35 38.5,27.23 38.5,25.88 | 9.24,31.57 9.34,31.67 v9.34,33.4 10.16,34.21 11.48,34.21 12.49,35.23 12.49,37.06 13.51,38.07 v14.53,38.07 16.96,38.07 v18.18,39.29 | 4.77,11.45 4.26,11.96 4.26,28.32 v5.18,29.23 6.4,30.45 | 4.77,11.45 8.43,7.79 v8.43,7.18 13,2.61 15.14,2.61 | 38.5,18.97 38.5,13.18 v34.03,8.71 28.65,3.32 26.21,3.32 | 38.5,18.97 39.59,20.06 39.59,23.47 38.5,24.56 38.5,25.88 | v37.18,19.38 38.1,19.38 38.5,18.97 | v4.77,12.87 4.77,11.45 | v25.4,3.32 26.21,3.32 | v15.34,3.12 15.34,2.82 15.14,2.61 | v39.11,25.27 38.5,25.88 | 15.14,2.61 15.24,2.61 15.75,2.1 24.99,2.1 26.21,3.32
  Route15(power) 0.254: v28.04,32.99 26.85,32.99 26.12,33.72 25.69,33.72 25.38,33.41 25.38,32.06 v23.77,30.45
  Bottom 0.254: C13.1 37.18,18.78 v37.18,19.38 37.03,19.53 35.66,19.53 | U4.25 19.93,38.9 C5.1 18.21,39.32 | 18.21,39.32 v18.18,39.29 | U4.9 23.77,31.65 v23.77,30.45 | R9.1 v9.34,33.4 | U3.25 21.63,8.03 21.94,8.03 23.56,9.65 27.34,9.65 C10.2 30.48,8.29 v30.48,8.51 | v5.18,29.23 5.75,29.23 C14.1 7.71,27.28 R2.1 7.71,22.74 v7.72,22.73 | C2.1 2.72,17.54 C3.2 4.95,13.05 v4.77,12.87 | IC2.2 36.78,22.53 36.88,22.63 | C12.2 36.47,25.27 37.18,24.56 37.18,22.93 36.88,22.63 | R11.2 35.66,19.53 | U3.9 15.98,3.43 15.64,3.43 v15.34,3.12 | U2.9 7.11,20.37 U2.3 C1.1 9.7,19.43 v9.75,19.38 | 36.88,22.63 36.88,20.75 35.66,19.53 | 18.21,39.32 18.21,39.53 18.7,40.02 18.7,45.88 DEBUG_N_2510_SOCKET.2 16.35,48.23 16.35,59.1 17.27,60.02 20.11,60.02 | +20V_EXTERNAL_POWER.2 21.18,58.95 20.11,60.02 | +3.3V_EXTERNAL_POWER.2 29,59.25 28.24,60.02 20.11,60.02
  pour Route2(GND): 31.59,32.59 35.76,32.59 35.76,29.64 31.59,29.64
  pour Route2(GND): 30.17,11.15 34.44,11.15 34.44,8.2 30.17,8.2
  pour Route2(GND): 7.92,9.62 12.19,9.62 12.19,6.68 7.92,6.68
  pour Route2(GND): 6.4,31.57 9.24,31.57 9.24,28.62 6.4,28.62
I_OUT+  (via drill 0.35)
  Top 0.254: R29.1 26.82,34.11 v25.91,33.19 | U$1.6 18.66,8.27 18.66,8.76 20.02,10.13 v21.54,10.13 22.86,8.8 24.27,8.8 26.41,6.66 v26.41,4.44 | v17.47,1.29 17.49,1.28 17.49,1.58 18.3,2.39 U$1.18 | v24.48,12.77 29.96,12.77 v30.98,13.79
  Route15(power) 0.254: v21.54,10.13 22.23,10.83 23.06,10.83 23.9,11.67 23.9,12.19 v24.48,12.77 | v25.91,33.19 25.91,31.91 24.67,30.67 24.67,30.23 24.98,29.92 25,29.92 28.09,26.84 28.09,21.77 28.95,20.9 v30.99,20.9
  Bottom 0.254: IC2.4 31.96,21.88 v30.99,20.9 v30.98,20.89 v30.98,13.79 | v17.47,1.29 17.88,0.89 24.38,0.89 26.41,2.92 v26.41,4.44
I_OUT-  (via drill 0.35)
  Top 0.254: U$1.19 18.7,1.18 19.3,0.58 22.94,0.58 23.73,0.65 24.44,0.84 27.43,3.83 30.48,3.83 37.69,11.05 v37.69,11.35 | U$1.7 18.3,9.03 19.91,10.63 22.05,10.63 22.4,10.28 23.32,10.28 25.45,12.42 30.11,12.42 30.16,12.47 32.71,12.47 v35.15,14.91
  Bottom 0.254: IC2.3 35.34,21.02 R11.1 35.19,18.18 R10.2 | R10.2 37.45,16.81 C13.2 38.1,16.11 38.1,11.76 v37.69,11.35 | v35.15,14.91 35.15,16.77 R10.2
LA  (1 unrouted)
  Top 0.254: 37.17,20.57 36.29,21.45 35.52,21.45 35.15,21.82 35.15,22.33 U1.8 | 38.18,22.76 37.82,22.39 35.79,22.39 U1.1
P0.0_SMBUS0_SDA  (via drill 0.35)
  Top 0.254: U1.5 33.67,23.46 R5.1 34.33,26.59 v34.34,26.59 | IC3.24 20.08,37.29 19.91,37.46 v18.69,37.46
  Route2(GND) 0.254: v18.69,37.46 19.06,37.46 19.08,37.44 21.92,37.44 v24.08,39.6
  Route15(power) 0.254: v24.08,39.6 24.99,39.6 26.11,39.29 27.92,37.48 29.07,37.48 29.38,37.17 29.38,36.02 33.32,32.08 33.32,27.3 34.03,26.59 v34.34,26.59
P0.1_SMBUS0_SCL  (via drill 0.35)
  Top 0.254: v35.76,29.23 34.91,29.23 R6.1 37.04,28.62 38,27.67 38,24.86 36.59,23.46 U1.3 | IC3.23 20.58,37.5 20.11,37.97 v19.3,37.97
  Route2(GND) 0.254: v19.3,37.97 18.93,37.97 18.91,37.99 18.47,37.99 18.16,37.68 18.16,37.24 18.47,36.93 21.92,36.93 23.28,38.29 28.53,38.29 31.44,35.38 31.74,35.38 35.45,31.67 v35.75,31.67
  Route15(power) 0.254: v35.75,31.67 37.18,30.25 37.18,29.64 36.78,29.23 v35.76,29.23
P0.2_MUXD08_A0  (via drill 0.35)
  Top 0.254: U$1.15 14.97,5.22 v14.63,5.56 | IC3.22 21.08,37.41 21.74,38.07 21.74,39.49 22.04,39.8 22.45,39.8 23.37,38.88 27.41,38.88 27.64,38.78 28.96,37.45 29.06,37.45 29.36,37.15 v30.48,37.15
  Route2(GND) 0.254: v28.65,10.33 23.47,5.15 15.03,5.15 v14.63,5.56
  Bottom 0.254: v30.48,37.15 35.25,32.38 35.25,29.44 30.48,24.66 30.48,12.16 v28.65,10.33
P0.3_MUXD08_A1  (via drill 0.35)
  Top 0.254: IC3.21 21.58,37.31 22.6,38.33 27.47,38.33 v28.85,36.95 | U$1.14 15.85,5.62 v15.75,5.72
  Route2(GND) 0.254: v27.43,10.33 24.28,7.18 22.62,7.18 22.23,6.79 22.23,6.76 21.19,5.72 v15.75,5.72
  Bottom 0.254: v28.85,36.95 29.26,36.55 30.27,36.55 34.85,31.98 34.85,29.64 29.87,24.66 29.87,12.16 28.54,10.84 28.24,10.84 27.74,10.33 v27.43,10.33
P0.4_MUXD08_A2  (via drill 0.35)
  Top 0.254: U$1.10 15.78,7.22 v15.75,7.18 | IC3.20 22.15,36.61 22.15,37.36 22.55,37.77 v24.79,37.77
  Route2(GND) 0.254: v24.48,10.23 23.26,10.23 20.22,7.18 v15.75,7.18
  Bottom 0.254: v24.79,37.77 27.12,37.77 28.95,35.94 29.87,35.94 33.32,32.48 33.32,28.83 30.68,26.18 29.67,26.18 28.45,24.96 28.45,11.96 27.53,11.05 25.3,11.05 v24.48,10.23
P0.5_SHDN  (via drill 0.35)
  Top 0.254: IC3.19 22.58,36.78 v23.06,37.26 | U$1.16 16.12,4.82 v15.75,4.44
  Route2(GND) 0.254: v15.03,9.32 11.99,12.37 11.99,18.67 9.85,20.8 v9.85,23.85
  Route15(power) 0.254: v23.06,37.26 23.06,35.02 22.15,34.11 20.72,34.11 18.79,32.18 v18.79,30.45 18.62,30.45 18.1,30.98 14.71,30.98 14.7,30.96 13.1,30.96 9.85,27.71 v9.85,23.85 | v15.75,4.44 15.75,4.95 16.46,5.66 16.46,7.9 v15.03,9.32
  Bottom 0.254: U4.16 18.79,31.55 v18.79,30.45 | U2.1 7.83,21.83 v9.85,23.85 | U3.16 15.68,9.32 v15.03,9.32
P0.6_ADC
  Top 0.254: IC3.18 23.27,36.58 23.88,37.19 26.72,37.19 R29.2 28.14,35.77 R28.1
P0.7_IREF  (via drill 0.35)
  Top 0.254: v24.18,36.34 24.18,35.73 23.81,35.37 IC3.17
  Route2(GND) 0.254: v13.21,33.3 13.31,33.19 13.41,33.19 16.56,36.34 v24.18,36.34 24.6,36.77 28.22,36.77 29.97,35.02 31.6,35.02 v36.27,30.35 | v36.27,24.25 37.18,25.17 v37.18,27.61
  Bottom 0.254: R9.2 13.1,33.4 v13.21,33.3 | IC2.1 36.27,24.11 v36.27,24.25 | v37.18,27.61 37.18,29.44 v36.27,30.35
P1.0_FD  (via drill 0.35)
  Top 0.254: U1.4 35.18,24.32 R7.1 36.37,27.01 v36.37,27.81 | IC3.16 24.23,34.87 24.99,35.63 v24.99,36.24
  Route2(GND) 0.254: v36.37,27.81 33.22,27.81 31.7,29.33 31.7,30.21 31.72,30.23 31.72,30.67 30.88,31.5 v30.88,31.57
  Route15(power) 0.254: v30.88,31.57 26.21,36.24 v24.99,36.24
P1.4_MUXS16_A3  (via drill 0.35)
  Top 0.254: IC3.12 22.58,31.33 v22.96,30.96 19.71,27.71 19.71,27.3 17.78,25.37 14.21,25.37 13.99,25.59 13.99,26.51 11.93,28.57 7.01,28.57 3.86,25.42 3.86,19.27 4.51,18.61 4.51,17.9 3.96,17.35 3.96,17.13 9.45,11.65 v9.45,10.44
  Route15(power) 0.254: v9.45,10.44 10.46,9.42 v10.46,6.07
  Bottom 0.254: U4.10 22.33,31.58 v22.96,30.96 | U3.10 15.71,5.22 15.34,4.85 v14.13,4.85 v14.12,4.85 12.9,6.07 v10.46,6.07
P1.5_MUXS16_A2  (via drill 0.35)
  Top 0.254: IC3.11 22.08,30.9 v22.15,30.96 21.29,30.1 21.29,29.81 18.98,27.5 18.38,27.5 18.29,27.4 13.82,27.4 12.29,28.93 6.8,28.93 3.5,25.62 3.5,19.12 4.16,18.47 4.16,18.05 3.55,17.45 3.55,16.13 6,13.68 6.91,13.68 8.53,12.07 8.53,11.36 v8.63,11.25 | v14.02,7.49 14.02,6.37 v14.12,6.27
  Bottom 0.254: U4.11 21.93,31.17 v22.15,30.96 | U3.11 16.56,5.62 15.95,6.22 14.17,6.22 v14.12,6.27 | v8.63,11.25 8.63,8.91 10.06,7.49 v14.02,7.49
P1.6_MUXS16_A1  (via drill 0.35)
  Top 0.254: IC3.9 21.08,31.92 21.33,31.67 v21.33,30.96 20.94,30.56 20.94,29.96 19.4,28.43 15.33,28.43 14.48,29.28 6.65,29.28 3.15,25.78 3.15,15.82 7.11,11.86 v8.02,11.86
  Bottom 0.254: U4.14 20.73,31.56 v21.33,30.96 | U3.14 16.09,6.82 15.95,6.68 15.13,6.68 v14.83,6.98 9.95,6.98 8.02,8.91 v8.02,11.86
P1.7_MUXS16_A0  (via drill 0.35)
  Top 0.254: IC3.8 v20.58,30.96 20.58,30.11 20.11,29.64 6.4,29.64 2.74,25.98 2.74,15.62 9.75,8.61 v14.73,8.61
  Bottom 0.254: U4.15 20.33,31.21 v20.58,30.96 | U3.15 17.35,7.19 17.11,7.19 16.87,7.43 16.87,7.48 15.74,8.61 v14.73,8.61
P2.7_/_C2D  (via drill 0.35)
  Top 0.254: IC3.7 20.08,31.84 v19.5,31.26
  Route2(GND) 0.254: v19.5,31.26 19,31.26 v17.87,32.39 | v18.1,41.93 22.71,46.54 DEBUG_N_2510_SOCKET.4
  Route15(power) 0.254: v17.87,32.39 15.64,34.62 v15.64,36.35
  Bottom 0.254: v15.64,36.35 17.68,38.39 17.68,39.5 18.1,39.92 v18.1,41.93
RSTB_/_C2CK  (via drill 0.35)
  Top 0.254: IC3.6 18.76,33.37 v18.49,33.09 17.07,33.09 16.29,32.32 R27.1 16.29,32.95 v15.11,34.14
  Route15(power) 0.254: v16.36,39.09 17.17,39.9 18.49,39.9 19.4,40.81 v19.4,41.93
  Bottom 0.254: v15.11,34.14 15.11,37.84 v16.36,39.09 | v19.4,41.93 19.4,45.79 18.79,46.4 18.79,48.33 DEBUG_N_2510_SOCKET.7
S1A_14  (via drill 0.35)
  Top 0.254: J1.5 22.37,19.66 v22.35,19.68
  Route2(GND) 0.254: v17.37,12.06 17.37,14.09 15.44,16.02 15.44,19.11 16.32,19.99 22.04,19.99 v22.35,19.68
  Bottom 0.254: U3.17 17.9,11.53 v17.37,12.06
S1B_22  (via drill 0.35)
  Top 0.254: J3.6 17.9,20.93 v17.98,21
  Route2(GND) 0.254: v17.88,30.45 17.88,28.32 15.44,25.88 15.44,21.51 15.95,21 v17.98,21
  Bottom 0.254: U4.17 17.88,31.69 v17.88,30.45
S2A_8  (via drill 0.35)
  Top 0.254: J2.5 16.74,19.66 v16.46,19.38
  Route2(GND) 0.254: v18.29,12.06 18.29,14.2 17.17,15.31 17.17,18.67 v16.46,19.38
  Bottom 0.254: U3.18 18.3,12.05 v18.29,12.06
S2B_27  (via drill 0.35)
  Top 0.254: J2.6 24.1,20.93 v24.18,21
  Route2(GND) 0.254: v17.17,30.45 17.17,28.52 15.03,26.39 15.03,20.9 15.54,20.39 21.84,20.39 22.45,21 v24.18,21
  Bottom 0.254: v17.17,30.45 17.17,32.48 18.28,33.59 19.39,33.59 U4.18
S3A_3  (via drill 0.35)
  Top 0.254: J3.5 12.01,19.66 v11.17,20.49
  Route2(GND) 0.254: v19,12.06 18.81,11.88 18.81,11.84 18.32,11.35 13.92,11.35 12.49,12.77 12.49,19.17 v11.17,20.49
  Bottom 0.254: U3.19 18.7,11.77 v19,12.06
S3B_15  (via drill 0.35)
  Top 0.254: J1.6 28.22,20.93 v29.26,19.88
  Route15(power) 0.254: v16.36,30.45 16.36,29.84 17.57,28.62 25.8,28.62 27.73,26.69 27.73,21.41 v29.26,19.88
  Bottom 0.254: U4.19 19.36,33.97 18.16,33.97 16.36,32.17 v16.36,30.45
S4A_13  (via drill 0.35)
  Top 0.254: J1.4 28.42,18.39 v29.26,17.55
  Route2(GND) 0.254: v19.71,12.06 19.89,11.88 19.89,11.84 20.94,10.79 23.92,10.79 24.07,10.94 28.95,10.94 30.38,12.37 30.38,16.43 v29.26,17.55
  Bottom 0.254: U3.20 19.1,11.46 v19.71,12.06
S4B_4  (via drill 0.35)
  Top 0.254: J3.7 12.01,22.2 v11.17,23.03
  Route2(GND) 0.254: v11.17,23.03 11.78,23.64 11.78,26.49 10.56,27.71 10.56,30.45 12.19,32.08 15.24,32.08 15.64,31.67 v15.64,30.45
  Bottom 0.254: U4.20 19.36,34.37 18.06,34.37 15.64,31.96 v15.64,30.45
S5A_26  (via drill 0.35)
  Top 0.254: J2.4 24.1,18.39 v24.18,18.46
  Route2(GND) 0.254: v20.42,12.06 20.6,11.88 20.6,11.84 21.3,11.15 23.77,11.15 25.19,12.57 25.19,17.45 v24.18,18.46
  Bottom 0.254: U3.21 19.5,11.14 v20.42,12.06
S5B_9  (via drill 0.35)
  Top 0.254: J2.7 16.53,22.2 v16.46,22.12
  Route15(power) 0.254: v14.93,30.45 14.93,23.64 v16.46,22.12
  Bottom 0.254: U4.21 19.36,34.77 17.95,34.77 15.29,32.11 15.29,30.81 v14.93,30.45
S6A_21  (via drill 0.35)
  Top 0.254: J3.4 17.9,18.39 v17.98,18.46
  Route2(GND) 0.254: v21.13,12.06 21.13,17.55 20.22,18.46 v17.98,18.46
  Bottom 0.254: U3.22 19.9,10.83 v21.13,12.06
S6B_16  (via drill 0.35)
  Top 0.254: J1.7 22.37,22.2 v22.35,22.22
  Route15(power) 0.254: v15.54,28.93 16.36,28.93 17.47,27.81 19.91,27.81 21.23,26.49 21.23,23.34 v22.35,22.22
  Bottom 0.254: U4.22 17.9,35.22 14.94,32.25 14.94,31.27 14.12,30.45 14.12,29.74 14.93,28.93 v15.54,28.93
S7A_12  (via drill 0.35)
  Top 0.254: J1.3 22.37,17.12 v22.35,17.14
  Route2(GND) 0.254: v21.84,12.06 21.84,14.36 21.82,14.38 21.82,16.61 v22.35,17.14
  Bottom 0.254: U3.23 20.3,10.52 v21.84,12.06
S7B_23  (via drill 0.35)
  Top 0.254: J3.8 17.8,23.47 v17.98,23.64
  Route15(power) 0.254: v15.54,27.91 17.27,26.18 17.27,24.36 v17.98,23.64
  Bottom 0.254: U4.23 19.36,35.57 17.75,35.57 14.58,32.4 14.58,31.73 13.31,30.45 13.31,30.05 14.79,28.57 14.88,28.57 v15.54,27.91
S8A_7  (via drill 0.35)
  Top 0.254: J2.3 16.48,17.12 v16.46,17.14
  Route2(GND) 0.254: v20.42,13.38 19.81,13.99 v19.81,16.13
  Route15(power) 0.254: v22.55,12.06 22.37,12.25 22.37,12.28 21.27,13.38 v20.42,13.38 | v19.81,16.13 18.79,17.14 v16.46,17.14
  Bottom 0.254: U3.24 20.7,10.21 v22.55,12.06
S8B_28  (via drill 0.35)
  Top 0.254: J2.8 24.2,23.47 v24.28,23.54
  Route15(power) 0.254: v18.59,27 20.42,25.17 20.42,22.93 21.94,21.41 22.76,21.41 24.28,22.93 v24.28,23.54
  Bottom 0.254: U4.24 17.7,36.02 14.23,32.55 14.23,32.08 12.6,30.45 12.6,29.44 15.03,27 v18.59,27
S9A_6  (via drill 0.35)
  Top 0.254: J2.1 16.94,14.58 v16.46,14.09
  Route15(power) 0.254: v16.05,2.71 16.44,3.1 16.44,3.34 16.96,3.87 16.96,11.55 16.36,12.16 16.36,13.99 v16.46,14.09
  Bottom 0.254: U3.8 17.23,3.62 16.76,3.62 16.46,3.33 16.46,3.13 v16.05,2.71
S9B_29  (via drill 0.35)
  Top 0.254: J2.10 23.7,26.01 v24.18,26.49
  Route2(GND) 0.254: v24.18,26.49 24.18,27.4 25.19,28.42 v25.19,30.45
  Bottom 0.254: U4.8 25.19,31.28 v25.19,30.45
S10A_11  (via drill 0.35)
  Top 0.254: J1.1 22.37,14.58 v22.35,14.6
  Route15(power) 0.254: v17.57,2.71 17.57,9.83 19.28,11.53 22.77,11.53 23.2,11.96 23.2,13.75 v22.35,14.6
  Bottom 0.254: U3.7 18.3,3.44 v17.57,2.71
S10B_24  (via drill 0.35)
  Top 0.254: J3.10 17.5,26.01 v17.98,26.49
  Route2(GND) 0.254: v26.01,30.45 26.01,27.2 24.48,25.68 18.79,25.68 v17.98,26.49
  Bottom 0.254: U4.7 23.3,33.57 23.6,33.57 26.01,31.16 v26.01,30.45
S11A_20  (via drill 0.35)
  Top 0.254: J3.2 17.9,15.85 v17.98,15.92
  Route15(power) 0.254: v14.63,3.32 12.7,5.25 12.7,12.37 16.25,15.92 v17.98,15.92
  Bottom 0.254: U3.6 18.66,4.25 18.66,3.09 17.67,2.1 15.24,2.1 14.63,2.71 v14.63,3.32
S11B_18  (via drill 0.35)
  Top 0.254: J1.9 22.43,24.74 v22.35,24.66
  Route2(GND) 0.254: v26.82,30.45 26.82,27 24.48,24.66 v22.35,24.66
  Bottom 0.254: U4.6 23.3,33.97 23.7,33.97 26.82,30.85 v26.82,30.45
S12A_25  (via drill 0.35)
  Top 0.254: J2.2 24.1,15.85 v24.18,15.92
  Route15(power) 0.254: v24.28,3.02 25.7,4.44 25.7,14.4 v24.18,15.92
  Bottom 0.254: U3.5 19.1,2 19.76,1.34 23.01,1.34 24.28,2.61 v24.28,3.02
S12B_10  (via drill 0.35)
  Top 0.254: J2.9 16.53,24.74 v16.46,24.66
  Route2(GND) 0.254: v27.73,30.45 27.17,29.89 27.17,25.83 25.47,24.13 22.13,24.13 21.6,24.66 v16.46,24.66
  Bottom 0.254: U4.5 23.77,34.42 v27.73,30.45
S13A_30  (via drill 0.35)
  Top 0.254: J1.2 28.32,15.85 v29.26,14.91
  Route15(power) 0.254: v23.47,3.02 25.19,4.75 25.19,14.16 23.65,15.7 23.65,16.14 23.96,16.45 24.4,16.45 25.94,14.91 v29.26,14.91
  Bottom 0.254: U3.4 19.5,2.21 20.02,1.7 22.45,1.7 23.47,2.71 v23.47,3.02
S13B_5  (via drill 0.35)
  Top 0.254: J3.9 12.21,24.74 v11.17,25.78
  Route2(GND) 0.254: v11.17,25.78 10.16,26.79 10.16,30.65 11.99,32.48 17.13,32.48 18.27,33.62 18.71,33.62 19.84,32.48 27.63,32.48 28.65,31.47 v28.65,30.45
  Bottom 0.254: U4.4 24.08,34.82 25.2,33.7 26.11,33.7 26.41,33.4 26.41,32.69 v28.65,30.45
S14B  (via drill 0.35)
  Bottom 0.254: v29.46,30.45 26.76,33.15 26.76,33.55 25.09,35.22 U4.3
S15A_2  (via drill 0.35)
  Top 0.254: J3.3 11.91,17.12 v11.17,17.85
  Route15(power) 0.254: v20.62,2.71 17.98,5.36 17.98,9.62 19.54,11.18 22.92,11.18 23.55,11.81 23.55,14.15 22.57,15.13 22.13,15.13 22.11,15.11 19.81,15.11 18.29,16.63 16.69,16.63 16.67,16.61 16.24,16.61 16.22,16.63 12.39,16.63 v11.17,17.85
  Bottom 0.254: U3.2 20.3,3.04 v20.62,2.71
S15B_17  (via drill 0.35)
  Top 0.254: J1.8 28.32,23.47 v29.26,22.53
  Route2(GND) 0.254: v29.26,22.53 29.26,24.25 28.55,24.96 28.55,25.47 30.38,27.3 v30.38,30.45
  Bottom 0.254: v30.38,30.45 28.54,32.29 28.54,33.2 26.12,35.62 U4.2
S16A_1  (via drill 0.35)
  Top 0.254: J3.1 12.01,14.58 v11.17,15.41
  Route2(GND) 0.254: v21.64,3.02 21.06,3.02 20.84,3.24 17.69,3.24 17.08,3.85 14.41,3.85 14.39,3.83 13.31,4.92 13.31,10.13 11.17,12.26 v11.17,15.41
  Bottom 0.254: U3.1 21.64,3.36 v21.64,3.02
S16B_19  (via drill 0.35)
  Top 0.254: J1.10 28.32,26.01 v29.26,25.07
  Route2(GND) 0.254: v29.26,25.07 29.26,25.47 30.88,27.1 30.88,30.15 v31.19,30.45
  Bottom 0.254: v31.19,30.45 28.9,32.74 28.9,33.35 25.29,36.95 23.87,36.95 23.57,36.65 23.57,36.33 U4.1
SW
  Bottom 0.254: U2.4 8.63,19.12 L1.P$2
VREF
  Bottom 0.254: U2.7 3.95,20.82 R1.2

### Text on the board
tNames: +3.3V | GND
bNames: +20V / plane | Converted 20V